# Altium schematic sheet Sheet1.SchDoc
size A4
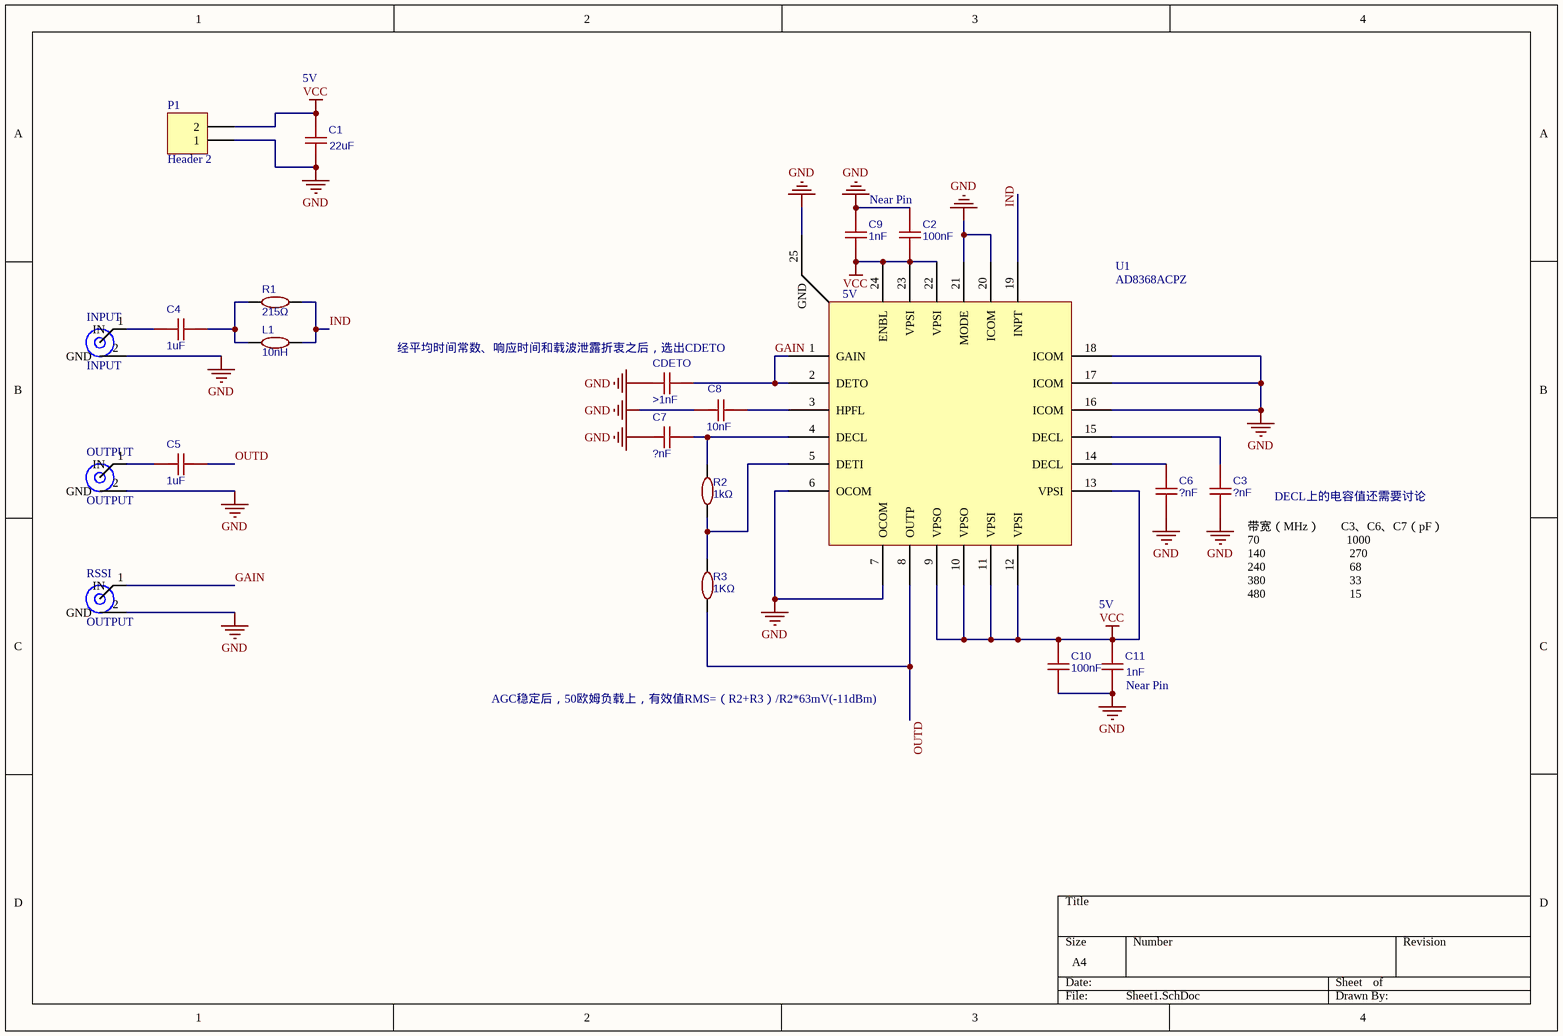
[diagram p0: Sheet1.SchDoc]

## Parts
C1  22uF  [0603]
C2  100nF  [0603]
C3  ?nF  [0603]
C4  1uF  [0603]
C5  1uF  [0603]
C6  ?nF  [0603]
C7  ?nF  [0603]
C8  10nF  [0603]
C9  1nF  [0603]
C10  100nF  [0603]
C11  1nF  [0603]
CDETO  >1nF  [0603]
INPUT  INPUT  [SMA-2]
L1  10nH  [0603]
OUTPUT  OUTPUT  [SMA-2]
P1  Header 2  [HDR1X2]
R1  215Ω  [0603]
R2  1kΩ  [0603]
R3  1KΩ  [0603]
RSSI  OUTPUT  [SMA-2]
U1  AD8368ACPZ  [LFCSP-24_4X4X05P]

## Nets
GND: C1.1 C2.1 C3.1 C6.1 C7.2 C8.2 C9.1 C10.1 C11.1 CDETO.2 INPUT.2(GND) OUTPUT.2(GND) P1.1 RSSI.2(GND) U1.6(OCOM) U1.7(OCOM) U1.16(ICOM) U1.17(ICOM) U1.18(ICOM) U1.20(ICOM) U1.21(MODE) U1.25(GND)
VCC: C1.2 C2.2 C9.2 C10.2 C11.2 P1.2 U1.9(VPSO) U1.10(VPSO) U1.11(VPSI) U1.12(VPSI) U1.13(VPSI) U1.22(VPSI) U1.23(VPSI) U1.24(ENBL)
GAIN: CDETO.1 RSSI.1(IN) U1.1(GAIN) U1.2(DETO)
IND: L1.2 R1.2 U1.19(INPT)
OUTD: C5.1 R3.1 U1.8(OUTP)
NetC3_2: C3.2 U1.15(DECL)
NetC4_1: C4.1 L1.1 R1.1
NetC4_2: C4.2 INPUT.1(IN)
NetC5_2: C5.2 OUTPUT.1(IN)
NetC6_2: C6.2 U1.14(DECL)
NetC7_1: C7.1 R2.2 U1.4(DECL)
NetC8_1: C8.1 U1.3(HPFL)
NetR2_1: R2.1 R3.2 U1.5(DETI)

## Notes on the sheet
- (near C1) 5V
- Near Pin
- (near U1) 5V
- 经平均时间常数、响应时间和载波泄露折衷之后，选出CDETO
- DECL上的电容值还需要讨论
- 5V
- (near C3) 带宽（MHz）       C3、C6、C7（pF）
  70                             1000
  140                            270
  240                            68
  380                            33
  480                            15
- AGC稳定后，50欧姆负载上，有效值RMS=（R2+R3）/R2*63mV(-11dBm)
- (near C11) Near Pin

## Library data of the parts
C1-C11 CDETO = C: BOM_Manufacturer: YAGEO; BOM_Manufacturer Part: CC0603KRX7R7BB104; nameAlias: Capacitance; Contributor: LCSC; BOM_Supplier: LCSC; BOM_Supplier Part: C108079; spicePre: C; spiceSymbolName: CC0603KRX7R7BB104
INPUT OUTPUT RSSI = SMA: pin to pad: 2>2+3
L1 R1-R3 = R: BOM_Manufacturer Part: TC0350D1002T5E; BOM_Manufacturer: UniOhm; nameAlias: Value; BOM_Supplier: LCSC; BOM_Supplier Part: C64266; spicePre: R; spiceSymbolName: TC0350D1002T5E
P1 = Header 2: Header, 2-Pin; LatestRevisionDate: 17-Jul-2002; LatestRevisionNote: Re-released for DXP Platform.; Publisher: Altium Limited
U1 = AD8368